# Altium project Module 15 PCB Introduction - Brendan Cook.PrjPcb
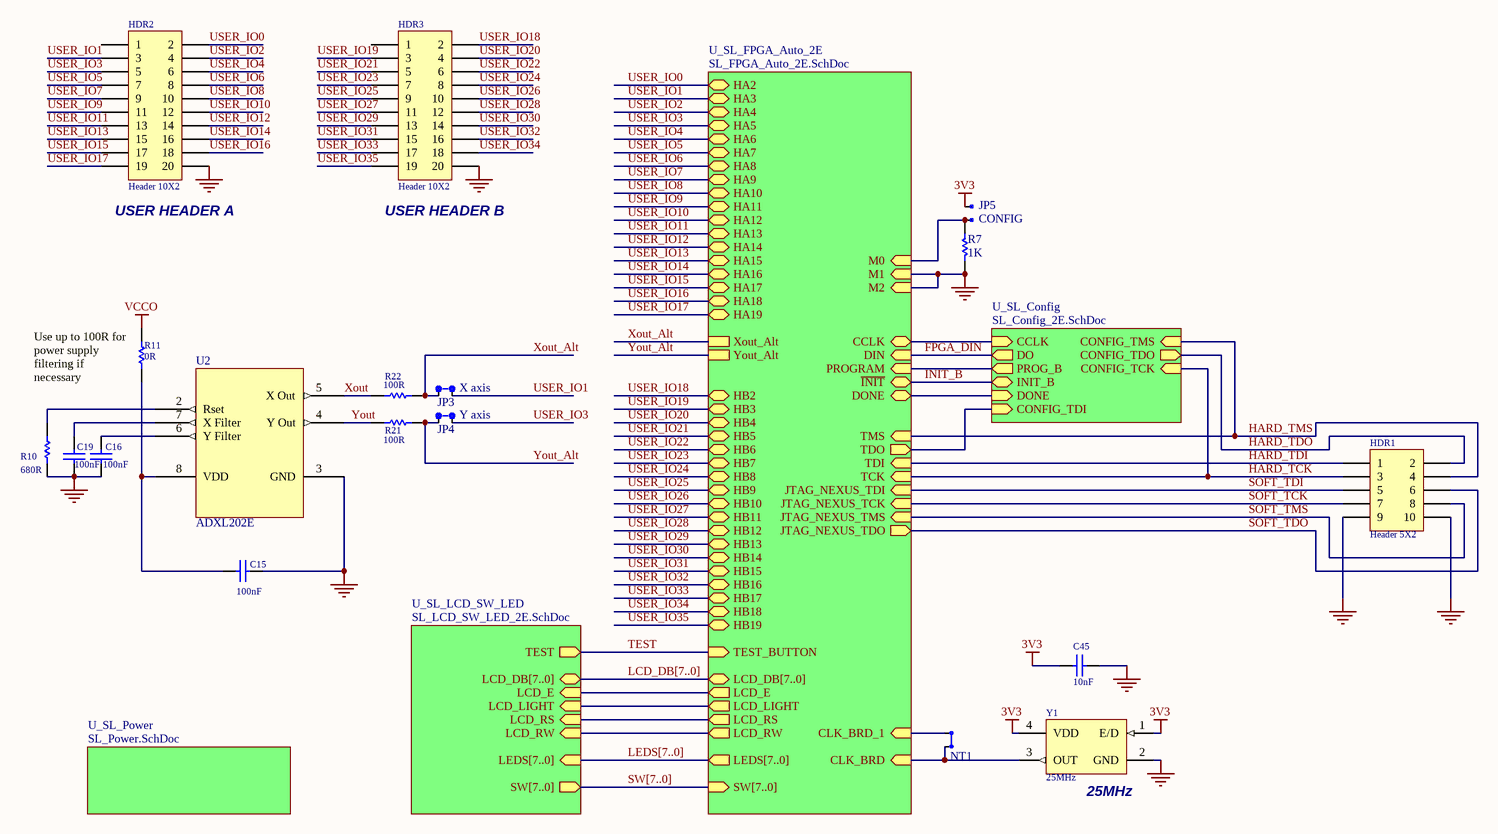
[diagram p0:  SL1 Xilinx Spartan-IIE PQ208 Rev1.02.SchDoc]
1 sheet, 20 parts. Net scope: hierarchical (ports join the sheet entries above them; power ports are global).
Board file:  SL1 Xilinx Spartan-IIE PQ208 Rev1.02.PcbDoc

## Sheet  SL1 Xilinx Spartan-IIE PQ208 Rev1.02.SchDoc: Spirit Level - Spartan 2E
size B; Organization: Altium Limited; Address1: L3, 12a Rodborough Rd; Address2: Frenchs Forest; Address3: NSW; Address4: Australia 2086; DocumentNumber: 5; SheetNumber: 5; SheetTotal: 5; Library Name: SpiritLevel_2E.SchLib

### Parts
C15  100nF  [CC1608-0603]
C16  100nF  [CC1608-0603]
C19  100nF  [CC1608-0603]
C45  10nF  [CC1608-0603]
HDR1  Header 5X2  [HDR2X5_LP]
HDR2  Header 10X2  [HDR2X10]
HDR3  Header 10X2  [HDR2X10]
JP3  X axis  [HDR1X2]
JP4  Y axis  [HDR1X2]
JP5  CONFIG  [HDR1X2]
JS2  Short Linking  (value not drawn)  (mechanical)
JS3  Shorting Link  (value not drawn)  (mechanical)
NT1  GND  [NT]  (value not drawn)  (net tie, no BOM)
R7  1K  [CR2012-0805]
R10  680R  [CR2012-0805]
R11  0R  [CR2012-0805]
R21  100R  [CR2012-0805]
R22  100R  [CR2012-0805]
U2  ADXL202E  [E-8]
Y1  25MHz  [QSMO_4200]

### Sub-sheets
U_SL_Config = SL_Config_2E.SchDoc (file not in this document): PROG_B (out), CONFIG_TDO (out), DO (out), CCLK (in), CONFIG_TDI (in), CONFIG_TCK (in), CONFIG_TMS (in), INIT_B (bidir), DONE (in)
U_SL_FPGA_Auto_2E = SL_FPGA_Auto_2E.SchDoc (file not in this document): CLK_BRD (in), HA10 (bidir), HA11 (bidir), HA12 (bidir), HA13 (bidir), HA14 (bidir), HA15 (bidir), HA16 (bidir), HA17 (bidir), HA18 (bidir), HA19 (bidir), HA2 (bidir), HA3 (bidir), HA4 (bidir), HA5 (bidir), HA6 (bidir), HA7 (bidir), HA8 (bidir), HA9 (bidir), HB10 (bidir), HB11 (bidir), HB12 (bidir), HB13 (bidir), HB14 (bidir), HB15 (bidir), HB16 (bidir), HB17 (bidir), HB18 (bidir), HB19 (bidir), HB2 (bidir), HB3 (bidir), HB4 (bidir), HB5 (bidir), HB6 (bidir), HB7 (bidir), HB8 (bidir), HB9 (bidir), JTAG_NEXUS_TCK (in), JTAG_NEXUS_TDI (in), JTAG_NEXUS_TDO (out), JTAG_NEXUS_TMS (in), LCD_DB[7..0] (bidir), LCD_E (out), LCD_LIGHT (out), LCD_RS (out), LCD_RW (out), LEDS[7..0] (out), SW[7..0] (in), TEST_BUTTON (in), CCLK (bidir), DONE (bidir), M0 (in), M1 (in), M2 (in), PROGRAM (in), TCK (in), TDI (in), TDO (out), TMS (in), DIN (in), ~{INIT} (bidir), CLK_BRD_1 (in), Xout_Alt, Yout_Alt
U_SL_LCD_SW_LED = SL_LCD_SW_LED_2E.SchDoc (file not in this document): TEST (out), SW[7..0] (out), LCD_DB[7..0] (bidir), LCD_E (in), LCD_RS (in), LCD_RW (in), LCD_LIGHT (in), LEDS[7..0] (in)
U_SL_Power = SL_Power.SchDoc (file not in this document): no entries

### Nets
3V3: C45.1 JP5.2 Y1.1(E/D) Y1.4(VDD)
GND: C15.2 C16.2 C19.2 C45.2 HDR1.9 HDR1.10 HDR2.20 HDR3.20 R7.1 R10.1 U2.3(GND) Y1.2(GND) ; sheet U_SL_FPGA_Auto_2E/M1, sheet U_SL_FPGA_Auto_2E/M2
VCCO: R11.1
FPGA_DIN: sheet U_SL_Config/DO, sheet U_SL_FPGA_Auto_2E/DIN
HARD_TCK: HDR1.3 ; sheet U_SL_Config/CONFIG_TCK, sheet U_SL_FPGA_Auto_2E/TCK
HARD_TDI: HDR1.1 ; sheet U_SL_FPGA_Auto_2E/TDI
HARD_TDO: HDR1.2 ; sheet U_SL_Config/CONFIG_TDO
HARD_TMS: HDR1.4 ; sheet U_SL_Config/CONFIG_TMS, sheet U_SL_FPGA_Auto_2E/TMS
INIT_B: sheet U_SL_Config/INIT_B, sheet U_SL_FPGA_Auto_2E/~{INIT}
SOFT_TCK: HDR1.7 ; sheet U_SL_FPGA_Auto_2E/JTAG_NEXUS_TCK
SOFT_TDI: HDR1.5 ; sheet U_SL_FPGA_Auto_2E/JTAG_NEXUS_TDI
SOFT_TDO: HDR1.6 ; sheet U_SL_FPGA_Auto_2E/JTAG_NEXUS_TDO
SOFT_TMS: HDR1.8 ; sheet U_SL_FPGA_Auto_2E/JTAG_NEXUS_TMS
TEST: sheet U_SL_LCD_SW_LED/TEST, sheet U_SL_FPGA_Auto_2E/TEST_BUTTON
USER_IO0: HDR2.2 ; sheet U_SL_FPGA_Auto_2E/HA2
USER_IO1: HDR2.3 JP3.2 ; sheet U_SL_FPGA_Auto_2E/HA3
USER_IO2: HDR2.4 ; sheet U_SL_FPGA_Auto_2E/HA4
USER_IO3: HDR2.5 JP4.2 ; sheet U_SL_FPGA_Auto_2E/HA5
USER_IO4: HDR2.6 ; sheet U_SL_FPGA_Auto_2E/HA6
USER_IO5: HDR2.7 ; sheet U_SL_FPGA_Auto_2E/HA7
USER_IO6: HDR2.8 ; sheet U_SL_FPGA_Auto_2E/HA8
USER_IO7: HDR2.9 ; sheet U_SL_FPGA_Auto_2E/HA9
USER_IO8: HDR2.10 ; sheet U_SL_FPGA_Auto_2E/HA10
USER_IO9: HDR2.11 ; sheet U_SL_FPGA_Auto_2E/HA11
USER_IO10: HDR2.12 ; sheet U_SL_FPGA_Auto_2E/HA12
USER_IO11: HDR2.13 ; sheet U_SL_FPGA_Auto_2E/HA13
USER_IO12: HDR2.14 ; sheet U_SL_FPGA_Auto_2E/HA14
USER_IO13: HDR2.15 ; sheet U_SL_FPGA_Auto_2E/HA15
USER_IO14: HDR2.16 ; sheet U_SL_FPGA_Auto_2E/HA16
USER_IO15: HDR2.17 ; sheet U_SL_FPGA_Auto_2E/HA17
USER_IO16: HDR2.18 ; sheet U_SL_FPGA_Auto_2E/HA18
USER_IO17: HDR2.19 ; sheet U_SL_FPGA_Auto_2E/HA19
USER_IO18: HDR3.2 ; sheet U_SL_FPGA_Auto_2E/HB2
USER_IO19: HDR3.3 ; sheet U_SL_FPGA_Auto_2E/HB3
USER_IO20: HDR3.4 ; sheet U_SL_FPGA_Auto_2E/HB4
USER_IO21: HDR3.5 ; sheet U_SL_FPGA_Auto_2E/HB5
USER_IO22: HDR3.6 ; sheet U_SL_FPGA_Auto_2E/HB6
USER_IO23: HDR3.7 ; sheet U_SL_FPGA_Auto_2E/HB7
USER_IO24: HDR3.8 ; sheet U_SL_FPGA_Auto_2E/HB8
USER_IO25: HDR3.9 ; sheet U_SL_FPGA_Auto_2E/HB9
USER_IO26: HDR3.10 ; sheet U_SL_FPGA_Auto_2E/HB10
USER_IO27: HDR3.11 ; sheet U_SL_FPGA_Auto_2E/HB11
USER_IO28: HDR3.12 ; sheet U_SL_FPGA_Auto_2E/HB12
USER_IO29: HDR3.13 ; sheet U_SL_FPGA_Auto_2E/HB13
USER_IO30: HDR3.14 ; sheet U_SL_FPGA_Auto_2E/HB14
USER_IO31: HDR3.15 ; sheet U_SL_FPGA_Auto_2E/HB15
USER_IO32: HDR3.16 ; sheet U_SL_FPGA_Auto_2E/HB16
USER_IO33: HDR3.17 ; sheet U_SL_FPGA_Auto_2E/HB17
USER_IO34: HDR3.18 ; sheet U_SL_FPGA_Auto_2E/HB18
USER_IO35: HDR3.19 ; sheet U_SL_FPGA_Auto_2E/HB19
Xout: R22.2 U2.5(X_Out)
Xout_Alt: JP3.1 R22.1 ; sheet U_SL_FPGA_Auto_2E/Xout_Alt
Yout: R21.2 U2.4(Y_Out)
Yout_Alt: JP4.1 R21.1 ; sheet U_SL_FPGA_Auto_2E/Yout_Alt
NetC15_1: C15.1 R11.2 U2.8(VDD)
NetC16_1: C16.1 U2.6(Y_Filter)
NetC19_1: C19.1 U2.7(X_Filter)
NetJP5_1: JP5.1 R7.2 ; sheet U_SL_FPGA_Auto_2E/M0
NetNT1_1: NT1.1 ; sheet U_SL_FPGA_Auto_2E/CLK_BRD_1
NetNT1_2: NT1.2 Y1.3(OUT) ; sheet U_SL_FPGA_Auto_2E/CLK_BRD
NetR10_2: R10.2 U2.2(Rset)
(unnamed): sheet U_SL_Config/PROG_B, sheet U_SL_FPGA_Auto_2E/PROGRAM
(unnamed): sheet U_SL_Config/CCLK, sheet U_SL_FPGA_Auto_2E/CCLK
(unnamed): sheet U_SL_Config/CONFIG_TDI, sheet U_SL_FPGA_Auto_2E/TDO
(unnamed): sheet U_SL_Config/DONE, sheet U_SL_FPGA_Auto_2E/DONE
(unnamed): sheet U_SL_LCD_SW_LED/LCD_E, sheet U_SL_FPGA_Auto_2E/LCD_E
(unnamed): sheet U_SL_LCD_SW_LED/LCD_RS, sheet U_SL_FPGA_Auto_2E/LCD_RS
(unnamed): sheet U_SL_LCD_SW_LED/LCD_RW, sheet U_SL_FPGA_Auto_2E/LCD_RW
(unnamed): sheet U_SL_LCD_SW_LED/LCD_LIGHT, sheet U_SL_FPGA_Auto_2E/LCD_LIGHT

Not connected (* = marked no-connect by the designer): HDR2 1; HDR3 1; U2 1(Self_Test)

### Buses and harness runs
bus LCD_DB[7..0] = sheet U_SL_FPGA_Auto_2E/LCD_DB[7..0] = sheet U_SL_LCD_SW_LED/LCD_DB[7..0]
bus LEDS[7..0] = sheet U_SL_FPGA_Auto_2E/LEDS[7..0] = sheet U_SL_LCD_SW_LED/LEDS[7..0]
bus SW[7..0] = sheet U_SL_FPGA_Auto_2E/SW[7..0] = sheet U_SL_LCD_SW_LED/SW[7..0]

### Notes on the sheet
- (near HDR2) USER HEADER A
- (near HDR3) USER HEADER B
- (near R11) Use up to 100R for power supply filtering if necessary
- (near Y1) 25MHz
- Title
- Size:
- Date:
- B
- Number:
- Time:
- Revision:
- Sheet
- of
- File:

### Library data of the parts
C15 C16 C19 = CAP: Capacitor; AEMS Code: 2101550
C45 = CAP: Capacitor; AEMS Code: 2100341
HDR1 = Header 5X2: Header, 5-Pin, Dual row; Revision: 17-Jul-2002: Re-released for DXP Platform.
HDR2 HDR3 = Header 10X2: Header, 10-Pin, Dual row; Revision: July-2002: Re-released for DXP Platform.
JP3-JP5 = Jumper, 2-Pin
JS2 JS3 = Jumper Socket: Shorting Link, 2.54mm (0.1") Pitch
NT1 = Jumper, 2-Pin_1: Jumper, 2-Pin
R7 = RES: Resistor; AEMS Code: 1200008JN
R10 = Res1: Resistor; AEMS Code: CHANGED VALUE; Revision: July-2002: Re-released for DXP Platform.
R11 = RES: Resistor; AEMS Code: 1200075
R21 R22 = Res1: Resistor; AEMS Code: 1200012JT; Revision: July-2002: Re-released for DXP Platform.
U2 = ADXL202E: Accelerometer with Digital Output
Y1 = QSMO_4200: Surface Mount Crystal Oscillator